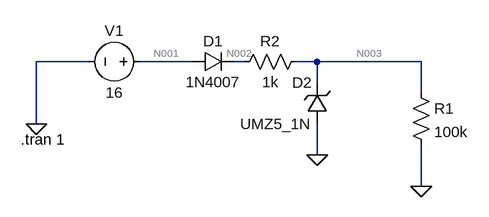
[diagram p0: schematic Draft1.asc]
Draft1.asc, the LTspice schematic file:
Version 4.1
SHEET 1 880 680
WIRE 144 144 64 144
WIRE 304 144 224 144
WIRE 384 144 368 144
WIRE 496 144 464 144
WIRE 656 144 496 144
WIRE 496 176 496 144
WIRE 656 192 656 144
WIRE 64 240 64 144
WIRE 496 288 496 240
WIRE 656 336 656 272
FLAG 64 240 0
FLAG 496 288 0
FLAG 656 336 0
SYMBOL voltage 240 144 R90
WINDOW 0 -32 56 VBottom 2
WINDOW 3 32 56 VTop 2
WINDOW 123 0 0 Left 0
WINDOW 39 0 0 Left 0
SYMATTR InstName V1
SYMATTR Value 16
SYMBOL diode 304 160 R270
WINDOW 0 32 32 VTop 2
WINDOW 3 0 32 VBottom 2
SYMATTR InstName D1
SYMATTR Value 1N4007
SYMBOL zener 512 240 R180
WINDOW 0 24 64 Left 2
WINDOW 3 24 0 Left 2
SYMATTR InstName D2
SYMATTR Value UMZ5_1N
SYMBOL res 640 176 R0
SYMATTR InstName R1
SYMATTR Value 100k
SYMBOL res 480 128 R90
WINDOW 0 0 56 VBottom 2
WINDOW 3 32 56 VTop 2
SYMATTR InstName R2
SYMATTR Value 1k
TEXT 40 264 Left 2 !.tran 1

The netlist it stands for:
* Draft1.asc
V1 N001 0 16
D1 N001 N002 1N4007
D2 0 N003 UMZ5_1N
R1 N003 0 100k
R2 N003 N002 1k
.model D D
.lib standard.dio
.tran 1
.backanno
.end

* Results of the author's LTspice run, read from the files saved beside the schematic
* Operating Point, zero values left out:
*   V(n002) = 15.33 V
*   V(n001) = 16 V
*   V(n003) = 5.098 V
*   I(V1) = -10.23 mA
*   I(R2) = -10.23 mA
*   I(D2) = -10.18 mA
*   I(D1) = 10.23 mA
*   I(R1) = 50.98 µA